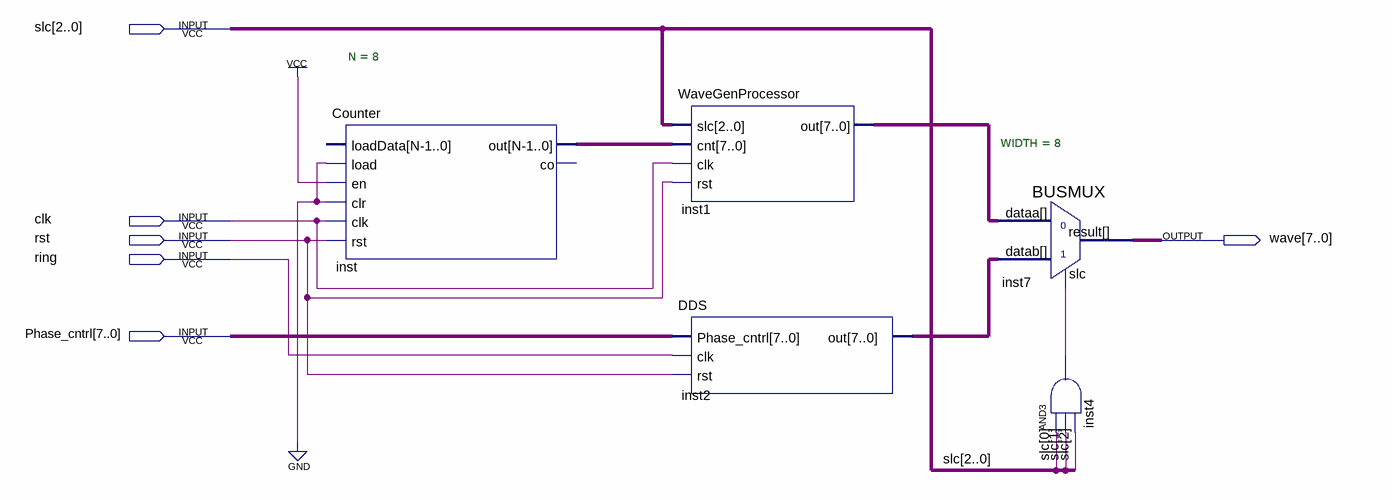
[diagram p0: schematic sheet]
// Quartus schematic WaveGen.bdf as structural Verilog: 5 symbols, 6 pins
module WaveGen (
  input  [2:0] slc,
  input  clk,
  input  rst,
  input  ring,
  input  [7:0] Phase_cntrl,
  output [7:0] wave
);

  wire inst4_out;
  wire [7:0] inst1_out, inst2_out, inst_out;

  Counter #(.N(8)) inst (
    .load(1'b0), .en(1'b1), .clr(1'b0), .clk(clk), .rst(rst), .out(inst_out));  // open: loadData, co
  WaveGenProcessor inst1 (.slc(slc), .cnt(inst_out), .clk(clk), .rst(rst), .out(inst1_out));
  DDS inst2 (.Phase_cntrl(Phase_cntrl), .clk(ring), .rst(rst), .out(inst2_out));
  BUSMUX #(.WIDTH(8)) inst7 (.datab(inst2_out), .slc(inst4_out), .dataa(inst1_out), .result(wave));
  and inst4 (inst4_out, slc[0], slc[1], slc[2]);
endmodule
